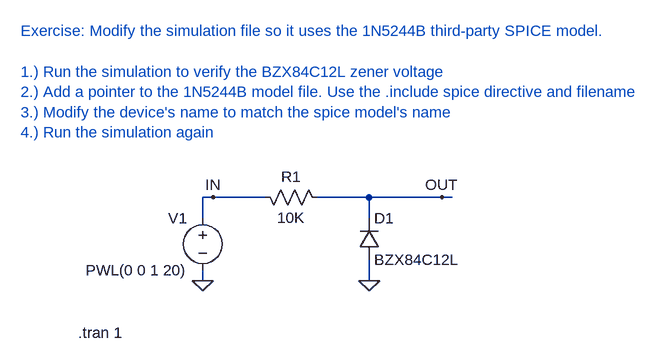
[diagram p0: schematic ZenerImportExample.asc]
ZenerImportExample.asc, the LTspice schematic file:
Version 4
SHEET 1 1048 680
WIRE -64 16 -80 16
WIRE 16 16 -64 16
WIRE 176 16 96 16
WIRE 288 16 176 16
WIRE 304 16 288 16
WIRE -80 48 -80 16
WIRE 176 48 176 16
WIRE -80 144 -80 128
WIRE 176 144 176 112
FLAG 176 144 0
FLAG -80 144 0
FLAG 288 16 OUT
FLAG -64 16 IN
SYMBOL res 0 0 M90
WINDOW 0 0 56 VBottom 2
WINDOW 3 32 56 VTop 2
SYMATTR InstName R1
SYMATTR Value 10K
SYMBOL voltage -80 32 M0
WINDOW 123 0 0 Left 2
WINDOW 39 0 0 Left 2
SYMATTR InstName V1
SYMATTR Value PWL(0 0 1 20)
SYMBOL diode 160 112 M180
WINDOW 0 24 64 Left 2
WINDOW 3 24 0 Left 2
SYMATTR InstName D1
SYMATTR Value BZX84C12L
TEXT -272 224 Left 2 !.tran 1
TEXT -360 -240 Left 2 ;Exercise: Modify the simulation file so it uses the 1N5244B third-party SPICE model.\n \n1.) Run the simulation to verify the BZX84C12L zener voltage\n2.) Add a pointer to the 1N5244B model file. Use the .include spice directive and filename\n3.) Modify the device's name to match the spice model's name\n4.) Run the simulation again

The netlist it stands for:
* ZenerImportExample.asc
R1 IN OUT 10K
V1 IN 0 PWL(0 0 1 20)
D1 0 OUT BZX84C12L
.model D D
.lib standard.dio
.tran 1
* Exercise: Modify the simulation file so it uses the 1N5244B third-party SPICE model.
* 1.) Run the simulation to verify the BZX84C12L zener voltage
* 2.) Add a pointer to the 1N5244B model file. Use the .include spice directive and filename
* 3.) Modify the device's name to match the spice model's name
* 4.) Run the simulation again
.backanno
.end